# Altium schematic sheet UVS-SCH-1.SchDoc
size A4
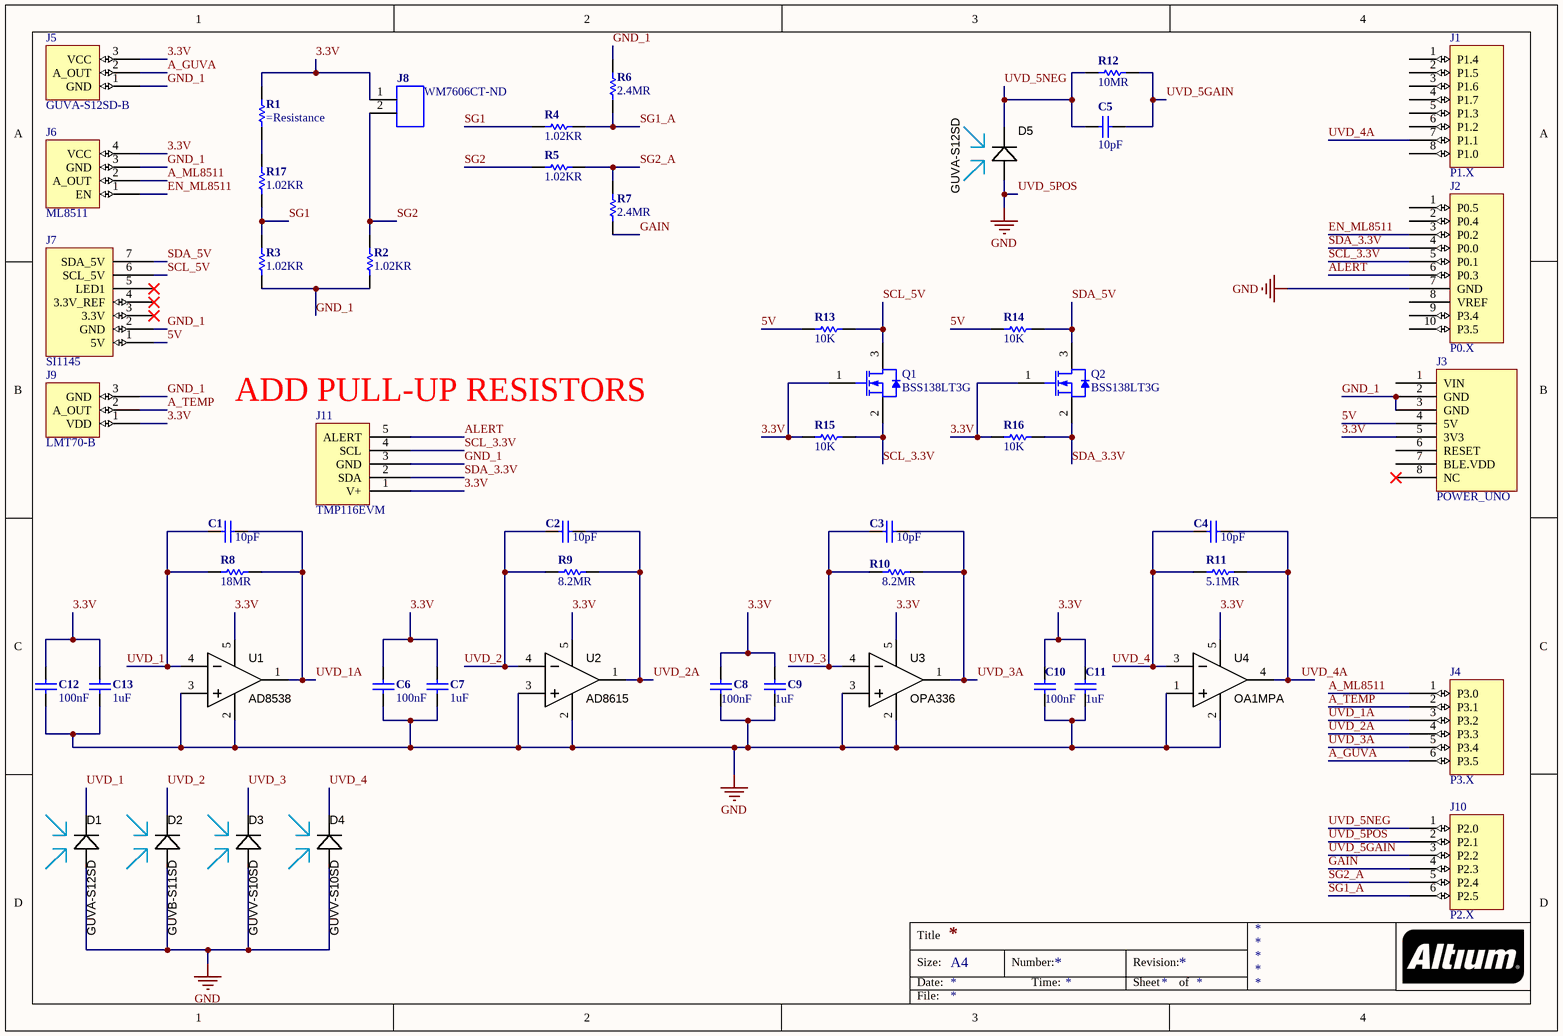
[diagram p0: UVS-SCH-1.SchDoc]

## Parts
C1  10pF  [CAP-0805(2012)-R]
C2  10pF  [CAP-0805(2012)-R]
C3  10pF  [CAP-0805(2012)-R]
C4  10pF  [CAP-0805(2012)-R]
C5  10pF  [CAP-0805(2012)-R]
C6  100nF  [CAP-0805(2012)-R]
C7  1uF  [CAP-0805(2012)-R]
C8  100nF  [CAP-0805(2012)-R]
C9  1uF  [CAP-0805(2012)-R]
C10  100nF  [CAP-0805(2012)-R]
C11  1uF  [CAP-0805(2012)-R]
C12  100nF  [CAP-0805(2012)-R]
C13  1uF  [CAP-0805(2012)-R]
D1  GUVA-S12SD  [SMD 3528]
D2  GUVB-S11SD  [SMD 3528]
D3  GUVV-S10SD  [SMD 3528]
D4  GUVV-S10SD  [SMD 3528]
D5  GUVA-S12SD  [SMD 3528]
J1  P1.X  [Header 8x1 8.5mm]
J2  P0.X  [Header 10x1 8.5mm]
J3  POWER_UNO  [Header 8x1 8.5mm]
J4  P3.X  [Header 6x1 8.5mm]
J5  GUVA-S12SD-B  [Header 3x1 8.5mm]
J6  ML8511  [Header 4x1 8.5mm]
J7  SI1145  [Header 7x1 8.5mm]
J8  Header 2 pin  [WM7606CT-ND]  (value not drawn)
J9  LMT70-B  [Header 3x1 8.5mm]
J10  P2.X  [Header 6x1 8.5mm]
J11  TMP116EVM  [Header 5x1 8.5mm]
Q1  BSS138LT3G  [ONSC-SOT-23-3-318-08_V]
Q2  BSS138LT3G  [ONSC-SOT-23-3-318-08_V]
R1  (no value)  [R-0805(2012)-R]
R2  1.02KR  [R-0805(2012)-R]
R3  1.02KR  [R-0805(2012)-R]
R4  1.02KR  [R-0805(2012)-R]
R5  1.02KR  [R-0805(2012)-R]
R6  2.4MR  [R-0805(2012)-R]
R7  2.4MR  [R-0805(2012)-R]
R8  18MR  [R-0805(2012)-R]
R9  8.2MR  [R-0805(2012)-R]
R10  8.2MR  [R-0805(2012)-R]
R11  5.1MR  [R-0805(2012)-R]
R12  10MR  [R-0805(2012)-R]
R13  10K  [R-0805(2012)-R]
R14  10K  [R-0805(2012)-R]
R15  10K  [R-0805(2012)-R]
R16  10K  [R-0805(2012)-R]
R17  1.02KR  [R-0805(2012)-R]
U1  AD8538  [SOT23-5]
U2  AD8615  [SOT23-5]
U3  OPA336  [SOT23-5]
U4  OA1MPA  [SC70-5L]

## Nets
UVD_5POS: C6.2 C7.2 C8.2 C9.2 C10.2 C11.2 C12.2 C13.2 D1.A D2.A D3.A D4.A D5.A J2.7(GND) J10.2(P2.1) U1.2(V-) U1.3(IN+) U2.2(V-) U2.3(IN+) U3.2(V-) U3.3(IN+) U4.1(OUT) U4.2(V-)  [also labelled GND]
3.3V: C6.1 C7.1 C8.1 C9.1 C10.1 C11.1 C12.1 C13.1 J3.5(3V3) J5.3(VCC) J6.4(VCC) J8.1 J9.1(VDD) J11.1(V+) Q1.1(G) Q2.1(G) R1.1 R15.1 R16.1 U1.5(V+) U2.5(V+) U3.5(V+) U4.5(V+)
5V: J3.4(5V) J7.1(5V) R13.1 R14.1
A_GUVA: J4.6(P3.5) J5.2(A_OUT)
A_ML8511: J4.1(P3.0) J6.2(A_OUT)
A_TEMP: J4.2(P3.1) J9.2(A_OUT)
ALERT: J2.6(P0.3) J11.5(ALERT)
EN_ML8511: J2.3(P0.2) J6.1(EN)
GAIN: J10.4(P2.3) R7.2
GND_1: J3.2(GND) J3.3(GND) J5.1(GND) J6.3(GND) J7.2(GND) J9.3(GND) J11.3(GND) R2.2 R3.2 R6.1
SCL_3.3V: J2.5(P0.1) J11.4(SCL) Q1.2(S) R15.2
SCL_5V: J7.6(SCL_5V) Q1.3(D) R13.2
SDA_3.3V: J2.4(P0.0) J11.2(SDA) Q2.2(S) R16.2
SDA_5V: J7.7(SDA_5V) Q2.3(D) R14.2
SG1: R3.1 R4.1 R17.2
SG1_A: J10.6(P2.5) R4.2 R6.2
SG2: J8.2 R2.1 R5.1
SG2_A: J10.5(P2.4) R5.2 R7.1
UVD_1: C1.1 D1.K R8.1 U1.4(IN-)
UVD_1A: C1.2 J4.3(P3.2) R8.2 U1.1(OUT)
UVD_2: C2.1 D2.K R9.1 U2.4(IN-)
UVD_2A: C2.2 J4.4(P3.3) R9.2 U2.1(OUT)
UVD_3: C3.1 D3.K R10.1 U3.4(IN-)
UVD_3A: C3.2 J4.5(P3.4) R10.2 U3.1(OUT)
UVD_4: C4.1 D4.K R11.1 U4.3(IN+)
UVD_4A: C4.2 J1.7(P1.1) R11.2 U4.4(IN-)
UVD_5GAIN: C5.2 J10.3(P2.2) R12.2
UVD_5NEG: C5.1 D5.K J10.1(P2.0) R12.1
NetR1_2: R1.2 R17.1

Not connected (* = marked no-connect by the designer): J1 1(P1.4) 2(P1.5) 3(P1.6) 4(P1.7) 5(P1.3) 6(P1.2) 8(P1.0); J2 1(P0.5) 2(P0.4) 8(VREF) 9(P3.4) 10(P3.5); J3 1(VIN) 6(RESET) 7(BLE.VDD) 8(NC)*; J7 3(3.3V)* 4(3.3V_REF)* 5(LED1)*

## Notes on the sheet
- (near J11) ADD PULL-UP RESISTORS
- Title
- Size:
- Date:
- A4
- Number:
- Time:
- Revision:
- Sheet
- of
- File:

## Library data of the parts
C1-C4 = C-0805(2012): ___ OHM ___ mW 0805(2012) SMD; Manufacturer: Kemet; Manufacturer Part Number: C0805C100J5GAC-TU; Dielectric Material: Ceramic; Tolerance: 5%; Voltage Rating: 50V; Dielectric: C0G; Dissipation Factor: 0.1%; Temperature Coefficient: 30ppm/°C; Supplier 1: Mouser; Supplier Part Number 1: 80-C0805C100J5G; Stock 1: 118205; Pricing 1: 1=0.1, 10=0.04, 50=0.04, 100=0.028, 1000=0.019, 10000=0.012 (USD); Mount: Surface Mount; Case/Package: 0805; Number of Pins: 2; Case Code (Metric): 2012; Case Code (Imperial): 0805; Contact Material: Tin; Contact Plating: Tin; Min Operating Temperature: -55°C; Max Operating Temperature: 125°C; Capacitance: 10pF; Package Quantity: 1; Packaging: Tape and Reel; Voltage Rating (DC): 50V; Termination: SMD/SMT; Voltage: 50V; Length: 2mm; Height: 0.78mm; Width: 0.049inch; Depth: 1.25mm; Lead Pitch: 0.75mm; Thickness: 0.035inch; Radiation Hardening: No; Lead Free: Lead Free; REACH SVHC: No SVHC; ComponentLink1URL: https://datasheet.ciiva.com/144/docfinderpartnumber-c0805c100j5gactu-144802.pdf; ComponentLink1Description: https://datasheet.ciiva.com/144/docfinderpartnumber-c0805c100j5gactu-144802.pdf; ComponentLink2URL: https://datasheet.ciiva.com/6177/kem-c1003-c0g-smd-6177333.pdf; ComponentLink2Description: https://datasheet.ciiva.com/6177/kem-c1003-c0g-smd-6177333.pdf; ComponentLink3URL: https://datasheet.ciiva.com/28668/1789732-28668730.pdf; ComponentLink3Description: https://datasheet.ciiva.com/28668/1789732-28668730.pdf; ComponentLink4URL: https://datasheet.ciiva.com/5423/kem-c1003-c0g-smd-356956-5423483.pdf; ComponentLink4Description: https://datasheet.ciiva.com/5423/kem-c1003-c0g-smd-356956-5423483.pdf; ComponentLink5URL: https://datasheet.ciiva.com/14609/70095383-14609227.pdf; ComponentLink5Description: https://datasheet.ciiva.com/14609/70095383-14609227.pdf; ComponentLink6URL: https://datasheet.ciiva.com/2988/kem-c1003-c0g-smd-2988556.pdf; ComponentLink6Description: https://datasheet.ciiva.com/2988/kem-c1003-c0g-smd-2988556.pdf; ComponentLink7URL: https://datasheet.ciiva.com/7842/1725430-7842140.pdf; ComponentLink7Description: https://datasheet.ciiva.com/7842/1725430-7842140.pdf; ComponentLink8URL: https://datasheet.ciiva.com/7842/1725430-7842141.pdf; ComponentLink8Description: https://datasheet.ciiva.com/7842/1725430-7842141.pdf
C5 = C-0805(2012): ___ OHM ___ mW 0805(2012) SMD; Manufacturer: KEMET; Manufacturer Part Number: C0805C100J5GAC-TU; Dielectric Material: Ceramic; Tolerance: 5%; Voltage Rating: 50V; Dielectric: C0G; Dissipation Factor: 0.1%; Temperature Coefficient: 30ppm/°C; Supplier 1: Mouser; Supplier Part Number 1: 80-C0805C100J5G; Stock 1: 113433; Pricing 1: 1=0.1, 10=0.04, 50=0.04, 100=0.028, 1000=0.019, 10000=0.012 (USD); Mount: Surface Mount; Case/Package: 0805; Number of Pins: 2; Case Code (Metric): 2012; Case Code (Imperial): 0805; Contact Material: Tin; Contact Plating: Tin; Min Operating Temperature: -55°C; Max Operating Temperature: 125°C; Capacitance: 10pF; Package Quantity: 1; Packaging: Tape and Reel; Voltage Rating (DC): 50V; Termination: SMD/SMT; Voltage: 50V; Length: 2mm; Height: 0.78mm; Width: 0.049inch; Depth: 1.25mm; Lead Pitch: 0.75mm; Thickness: 0.035inch; Radiation Hardening: No; Lead Free: Lead Free; REACH SVHC: No SVHC; ComponentLink1URL: https://datasheet.ciiva.com/144/docfinderpartnumber-c0805c100j5gactu-144802.pdf; ComponentLink1Description: https://datasheet.ciiva.com/144/docfinderpartnumber-c0805c100j5gactu-144802.pdf; ComponentLink2URL: https://datasheet.ciiva.com/6177/kem-c1003-c0g-smd-6177333.pdf; ComponentLink2Description: https://datasheet.ciiva.com/6177/kem-c1003-c0g-smd-6177333.pdf; ComponentLink3URL: https://datasheet.ciiva.com/28668/1789732-28668730.pdf; ComponentLink3Description: https://datasheet.ciiva.com/28668/1789732-28668730.pdf; ComponentLink4URL: https://datasheet.ciiva.com/5423/kem-c1003-c0g-smd-356956-5423483.pdf; ComponentLink4Description: https://datasheet.ciiva.com/5423/kem-c1003-c0g-smd-356956-5423483.pdf; ComponentLink5URL: https://datasheet.ciiva.com/14609/70095383-14609227.pdf; ComponentLink5Description: https://datasheet.ciiva.com/14609/70095383-14609227.pdf; ComponentLink6URL: https://datasheet.ciiva.com/2988/kem-c1003-c0g-smd-2988556.pdf; ComponentLink6Description: https://datasheet.ciiva.com/2988/kem-c1003-c0g-smd-2988556.pdf; ComponentLink7URL: https://datasheet.ciiva.com/7842/1725430-7842140.pdf; ComponentLink7Description: https://datasheet.ciiva.com/7842/1725430-7842140.pdf; ComponentLink8URL: https://datasheet.ciiva.com/7842/1725430-7842141.pdf; ComponentLink8Description: https://datasheet.ciiva.com/7842/1725430-7842141.pdf
C6 C8 C10 C12 = C-0805(2012): ___ OHM ___ mW 0805(2012) SMD; Manufacturer: Yageo; Manufacturer Part Number: CC0805KRX7R9BB104; Material: Ceramic; Tolerance: 10%; Voltage Rating: 50V; Dielectric: X7R; Insulation Resistance: 100GR; Supplier 1: Mouser; Supplier Part Number 1: 603-CC805KRX7R9BB104; Stock 1: 432978; Pricing 1: 1=0.1, 10=0.037, 50=0.037, 100=0.017, 1000=0.013, 10000=0.009 (USD); Mount: Surface Mount; Case/Package: 0805; Number of Pins: 2; Case Code (Metric): 2012; Case Code (Imperial): 0805; Min Operating Temperature: -55°C; Max Operating Temperature: 125°C; Packaging: Tape and Reel; Capacitance: 100nF; Package Quantity: 1; Termination: SMD/SMT; Voltage: 50V; Length: 2mm; Height: 0.85mm; Width: 0.049inch; Thickness: 0.033inch; Depth: 1.25mm; Radiation Hardening: No; REACH SVHC: No SVHC; Lead Free: Lead Free; Halogen Free: Halogen Free; ComponentLink1URL: https://datasheet.ciiva.com/11464/upy-gphc-x7r-6-3v-to-50v-8-11464757.pdf; ComponentLink1Description: https://datasheet.ciiva.com/11464/upy-gphc-x7r-6-3v-to-50v-8-11464757.pdf; ComponentLink2URL: https://datasheet.ciiva.com/28450/1489800-28450805.pdf; ComponentLink2Description: https://datasheet.ciiva.com/28450/1489800-28450805.pdf; ComponentLink3URL: https://datasheet.ciiva.com/155/mlccorderingcode-155929.pdf; ComponentLink3Description: https://datasheet.ciiva.com/155/mlccorderingcode-155929.pdf; ComponentLink4URL: https://datasheet.ciiva.com/11786/0900766b80d84f1d-11786009.pdf; ComponentLink4Description: https://datasheet.ciiva.com/11786/0900766b80d84f1d-11786009.pdf; ComponentLink5URL: https://datasheet.ciiva.com/155/mlccorderingcode-155930.pdf; ComponentLink5Description: https://datasheet.ciiva.com/155/mlccorderingcode-155930.pdf; ComponentLink6URL: https://datasheet.ciiva.com/155/mlccorderingcode-155931.pdf; ComponentLink6Description: https://datasheet.ciiva.com/155/mlccorderingcode-155931.pdf; ComponentLink7URL: https://datasheet.ciiva.com/46393/1734573-46393307.pdf; ComponentLink7Description: https://datasheet.ciiva.com/46393/1734573-46393307.pdf; ComponentLink8URL: https://datasheet.ciiva.com/16625/upy-gphc-x7r-6-3v-to-50v-8-16625549.pdf; ComponentLink8Description: https://datasheet.ciiva.com/16625/upy-gphc-x7r-6-3v-to-50v-8-16625549.pdf; ComponentLink9URL: https://datasheet.ciiva.com/29242/445210-da-01-en-kerko-chip-0805-x7r-0-1uf-10proz-50vg-29242074.pdf; ComponentLink9Description: https://datasheet.ciiva.com/29242/445210-da-01-en-kerko-chip-0805-x7r-0-1uf-10proz-50vg-29242074.pdf
C7 C9 C11 C13 = C-0805(2012): ___ OHM ___ mW 0805(2012) SMD; Manufacturer: Yageo; Manufacturer Part Number: CC0805KKX7R7BB105; Tolerance: 10%; Voltage Rating: 16V; Dielectric: X7R; Supplier 1: Mouser; Supplier Part Number 1: 603-CC805KKX7R7BB105; Stock 1: 127286; Pricing 1: 1=0.1, 10=0.049, 50=0.049, 100=0.022, 1000=0.017, 10000=0.011 (USD); Case/Package: 0805; Case Code (Metric): 2012; Case Code (Imperial): 0805; Min Operating Temperature: -55°C; Max Operating Temperature: 125°C; Packaging: Tape and Reel; Capacitance: 1uF; Package Quantity: 1; Termination: SMD/SMT; Voltage Rating (DC): 16V; Length: 2mm; Width: 0.049inch; Thickness: 0.049inch; Depth: 1.25mm; Radiation Hardening: No; REACH SVHC: No SVHC; Lead Free: Lead Free; Halogen Free: Halogen Free; ComponentLink1URL: https://datasheet.ciiva.com/144/mlccorderingcode-144902.pdf; ComponentLink1Description: https://datasheet.ciiva.com/144/mlccorderingcode-144902.pdf; ComponentLink2URL: https://datasheet.ciiva.com/13173/upy-gp-np0-16v-to-50v-8-3714-13173254.pdf; ComponentLink2Description: https://datasheet.ciiva.com/13173/upy-gp-np0-16v-to-50v-8-3714-13173254.pdf; ComponentLink3URL: https://datasheet.ciiva.com/15189/getdatasheetpartid-251802-15189206.pdf; ComponentLink3Description: https://datasheet.ciiva.com/15189/getdatasheetpartid-251802-15189206.pdf; ComponentLink4URL: https://datasheet.ciiva.com/144/mlccorderingcode-144903.pdf; ComponentLink4Description: https://datasheet.ciiva.com/144/mlccorderingcode-144903.pdf; ComponentLink5URL: https://datasheet.ciiva.com/144/mlccorderingcode-144904.pdf; ComponentLink5Description: https://datasheet.ciiva.com/144/mlccorderingcode-144904.pdf; ComponentLink6URL: https://datasheet.ciiva.com/7978/1489800-7978201.pdf; ComponentLink6Description: https://datasheet.ciiva.com/7978/1489800-7978201.pdf; ComponentLink7URL: https://datasheet.ciiva.com/11464/upy-gphc-x7r-6-3v-to-50v-8-11464750.pdf; ComponentLink7Description: https://datasheet.ciiva.com/11464/upy-gphc-x7r-6-3v-to-50v-8-11464750.pdf; ComponentLink8URL: https://datasheet.ciiva.com/28450/1489800-28450750.pdf; ComponentLink8Description: https://datasheet.ciiva.com/28450/1489800-28450750.pdf
D1 D5 = GUVA-S12SD: UV Photodiode, 3528 SMD
D2 = GUVB-S11SD: UV Photodiode, 3528 SMD
D3 D4 = GUVV-S10SD: UV Photodiode, 3528 SMD
J1 = IOL
J2 = IOH
J4 = AD
J5 = GUVA-S12SD-B: UV Light Sensor Breakout Board
J6 = ML8511: UV Light Sensor Breakout Board
J7 = SI1145: UV Light Sensor Digital
J8 = CON-2Pin: Header, 2 pin, .1 pitch; Manufacturer: Molex, LLC; Manufacturer Part Number: 0533980271; Pitch - Mating: 0.049" (1.25mm); Style: Board to Cable/Wire; Shrouding: Shrouded - 3 Wall; Number of Positions: 2; Number of Positions Loaded: All; Material Flammability Rating: UL94 V-0; Supplier 1: Digi-Key; RoHS: RoHS Compliant; Category: Connectors, Interconnects; Stock 1: 38010; Pricing 1: 1=1.07, 10=0.941, 25=0.886, 50=0.849, 100=0.8122, 250=0.73832, 500=0.66448 (USD); Packaging: Cut Tape (CT); Part Status: Active; Connector Type: Header; Contact Type: Male Blade; Number of Rows: 1; Row Spacing - Mating: -; Mounting Type: Surface Mount; Termination: Solder; Fastening Type: Detent Lock; Contact Length - Mating: -; Contact Length - Post: -; Overall Contact Length: -; Insulation Height: 0.185" (4.70mm); Contact Shape: Rectangular; Contact Finish - Mating: Tin; Contact Finish Thickness - Mating: 39µin (1.00µm); Features: Solder Retention; Ingress Protection: -; Insulation Color: Natural; Contact Finish - Post: Tin; Contact Material: Phosphor Bronze; Insulation Material: Polyamide (PA), Nylon; Operating Temperature: -; Current Rating: -; Voltage Rating: -; Mated Stacking Heights: -; Contact Finish Thickness - Post: -; Applications: Automotive, General Purpose, Industrial, Medical; ComponentLink1URL: http://www.molex.com/pdm_docs/sd/533980271_sd.pdf; ComponentLink1Description: http://www.molex.com/pdm_docs/sd/533980271_sd.pdf; Supplier Part Number 1: WM7606CT-ND
J9 = LMT70-B: Precision Analog Temperature Sensor
Q1 Q2 = CMP-1058-00765-1: Power MOSFET, 200 mA, 50 V, N-Channel, 3-Pin SOT-23, Pb-Free, Tape and Reel; Manufacturer: ON Semiconductor; Nominal Vgs: 500mV; Input Capacitance: 50pF; Number of Elements: 1; Max Power Dissipation: 225mW; Rds On Max: 3.5R; Drain to Source Voltage (Vdss): 50V; Continuous Drain Current (ID): 200mA; Turn-Off Delay Time: 20ns; Element Configuration: Single; Gate to Source Voltage (Vgs): 20V; Supplier 1: Mouser; Supplier Part Number 1: 863-BSS138LT3G; Manufacturer Part Number: BSS138LT3G; Stock 1: 150086; Pricing 1: 1=0.25, 10=0.167, 50=0.167, 100=0.07, 1000=0.048, 10000=0.032 (USD); Case/Package: SOT-23-3; Number of Pins: 3; Min Operating Temperature: -55°C; Max Operating Temperature: 150°C; Package Quantity: 1; Packaging: Tape and Reel; Drain to Source Breakdown Voltage: 50V; Power Dissipation: 225mW; Drain to Source Resistance: 3.5R; Threshold Voltage: 500mV; Turn-On Delay Time: 20ns; Voltage Rating (DC): 50V; Current Rating: 200mA; Length: 2.9mm; Height: 0.94mm; Width: 1.3mm; Radiation Hardening: No; REACH SVHC: No SVHC; Lead Free: Lead Free; Halogen Free: Halogen Free; ComponentLink1URL: https://datasheet.ciiva.com/936/bss138lt1-d-936790.pdf; ComponentLink1Description: https://datasheet.ciiva.com/936/bss138lt1-d-936790.pdf; ComponentLink2URL: https://datasheet.ciiva.com/936/bss138lt1-d-936791.pdf; ComponentLink2Description: https://datasheet.ciiva.com/936/bss138lt1-d-936791.pdf; ComponentLink3URL: https://datasheet.ciiva.com/1190/1596366-1190138.pdf; ComponentLink3Description: https://datasheet.ciiva.com/1190/1596366-1190138.pdf; ComponentLink4URL: https://datasheet.ciiva.com/8059/bss138lt1-d-8059434.pdf; ComponentLink4Description: https://datasheet.ciiva.com/8059/bss138lt1-d-8059434.pdf; ComponentLink5URL: https://datasheet.ciiva.com/11164/bss138lt1-d-11164859.pdf; ComponentLink5Description: https://datasheet.ciiva.com/11164/bss138lt1-d-11164859.pdf; ComponentLink6URL: https://datasheet.ciiva.com/15198/getdatasheetpartid-141721-15198909.pdf; ComponentLink6Description: https://datasheet.ciiva.com/15198/getdatasheetpartid-141721-15198909.pdf; ComponentLink7URL: https://datasheet.ciiva.com/16449/bss138lt1-d-16449517.pdf; ComponentLink7Description: https://datasheet.ciiva.com/16449/bss138lt1-d-16449517.pdf
R1 = R-0805(2012): ___ OHM ___ mW 0805(2012) SMD
R2-R5 R17 = R-0805(2012): ___ OHM ___ mW 0805(2012) SMD; Manufacturer: Panasonic; Manufacturer Part Number: ERA6AEB1021V; Power Rating: 125mW; Tolerance: 0.1%; Voltage Rating: 200V; Temperature Coefficient: 25ppm/°C; Voltage Rating (DC): 100V; Supplier 1: Mouser; Supplier Part Number 1: 667-ERA-6AEB1021V; Stock 1: 5493; Pricing 1: 1=0.63, 10=0.249, 50=0.249, 100=0.149, 1000=0.076, 10000=0.039 (USD); Mount: Surface Mount; Case/Package: 0805; Number of Pins: 2; Case Code (Metric): 2012; Case Code (Imperial): 0805; Contact Plating: Tin; Min Operating Temperature: -55°C; Max Operating Temperature: 155°C; Composition: Metal Film,Thin Film; Resistance: 1.02KR; Packaging: Tape and Reel; Package Quantity: 1; Number of Terminations: 2; Termination: SMD/SMT; Max Power Dissipation: 125mW; Length: 2mm; Height: 0.5mm; Width: 1.25mm; Depth: 1.25mm; Radiation Hardening: No; REACH SVHC: No SVHC; Lead Free: Lead Free; ComponentLink1URL: https://datasheet.ciiva.com/5870/485442-5870581.pdf; ComponentLink1Description: https://datasheet.ciiva.com/5870/485442-5870581.pdf; ComponentLink2URL: https://datasheet.ciiva.com/5870/485442-5870582.pdf; ComponentLink3URL: https://datasheet.ciiva.com/24072/aoa0000ce26-197354-24072246.pdf; ComponentLink3Description: https://datasheet.ciiva.com/24072/aoa0000ce26-197354-24072246.pdf; ComponentLink4URL: https://datasheet.ciiva.com/30091/54aoa0000ce26-30091290.pdf; ComponentLink4Description: https://datasheet.ciiva.com/30091/54aoa0000ce26-30091290.pdf; ComponentLink5URL: https://datasheet.ciiva.com/7911/485442-7911579.pdf; ComponentLink5Description: https://datasheet.ciiva.com/7911/485442-7911579.pdf; ComponentLink6URL: https://datasheet.ciiva.com/9198/aoa0000ce26-9198827.pdf; ComponentLink6Description: https://datasheet.ciiva.com/9198/aoa0000ce26-9198827.pdf; ComponentLink7URL: https://datasheet.ciiva.com/7911/485442-7911580.pdf; ComponentLink7Description: https://datasheet.ciiva.com/7911/485442-7911580.pdf; ComponentLink8URL: https://datasheet.ciiva.com/11810/0900766b80eb1d8c-11810140.pdf; ComponentLink8Description: https://datasheet.ciiva.com/11810/0900766b80eb1d8c-11810140.pdf; ComponentLink9URL: https://datasheet.ciiva.com/17215/aoa0000ce26-17215164.pdf; ComponentLink9Description: https://datasheet.ciiva.com/17215/aoa0000ce26-17215164.pdf; ComponentLink10URL: https://datasheet.ciiva.com/26335/459032-da-01-en-widerstand-0805-era-26335793.pdf
  R2-R4 R17: ComponentLink2Description: https://datasheet.ciiva.com/5870/485442-5870582.pdf; ComponentLink10Description: https://datasheet.ciiva.com/26335/459032-da-01-en-widerstand-0805-era-26335793.pdf
R6 R7 = R-0805(2012): ___ OHM ___ mW 0805(2012) SMD; Manufacturer: Panasonic ECG; Manufacturer Part Number: ERJ-6GEYJ245V; Power Rating: 125mW; Tolerance: 5%; Voltage Rating: 150V; Temperature Coefficient: 150ppm/°C; Supplier 1: Mouser; Supplier Part Number 1: 667-ERJ-6GEYJ245V; Stock 1: 75536; Pricing 1: 1=0.1, 10=0.015, 50=0.015, 100=0.006, 1000=0.004, 10000=0.002 (USD); Mount: Surface Mount; Case/Package: 0805; Case Code (Imperial): 0805; Case Code (Metric): 2012; Contact Plating: Tin; Min Operating Temperature: -55°C; Max Operating Temperature: 155°C; Resistance: 2.4MR; Packaging: Tape and Reel; Package Quantity: 1; Termination: SMD/SMT; Composition: Thick Film; Number of Terminations: 2; Military Standard: Not; Max Power Dissipation: 125mW; Voltage Rating (DC): 150V; Length: 2mm; Height: 0.028inch; Width: 1.25mm; Depth: 1.25mm; REACH SVHC: No SVHC; Lead Free: Lead Free; ComponentLink1URL: https://datasheet.ciiva.com/9197/aoa0000ce1-9197110.pdf; ComponentLink1Description: https://datasheet.ciiva.com/9197/aoa0000ce1-9197110.pdf; ComponentLink2URL: https://datasheet.ciiva.com/46378/1678796-46378639.pdf; ComponentLink2Description: https://datasheet.ciiva.com/46378/1678796-46378639.pdf
R8 = R-0805(2012): ___ OHM ___ mW 0805(2012) SMD; Manufacturer: Yageo; Manufacturer Part Number: RC0805JR-0718ML; Tolerance: 5%; Power Rating: 125mW; Voltage Rating: 150V; Temperature Coefficient: 200ppm/°C; Supplier 1: Mouser; Supplier Part Number 1: 603-RC0805JR-0718ML; Stock 1: 23485; Pricing 1: 1=0.19, 10=0.045, 50=0.045, 100=0.015, 1000=0.011, 10000=0.006 (USD); Case/Package: 0805; Case Code (Imperial): 0805; Case Code (Metric): 2012; Min Operating Temperature: -55°C; Max Operating Temperature: 155°C; Resistance: 18MR; Packaging: Tape and Reel; Composition: Thick Film; Termination: SMD/SMT; Number of Terminations: 2; Military Standard: Not; Max Power Dissipation: 125mW; Length: 2mm; Height: 0.024inch; Width: 1.25mm; Depth: 1.25mm; REACH SVHC: Unknown; ComponentLink1URL: https://datasheet.ciiva.com/7941/442941-7941901.pdf; ComponentLink1Description: https://datasheet.ciiva.com/7941/442941-7941901.pdf; ComponentLink2URL: https://datasheet.ciiva.com/7941/442941-7941902.pdf; ComponentLink2Description: https://datasheet.ciiva.com/7941/442941-7941902.pdf
R9 R10 = R-0805(2012): ___ OHM ___ mW 0805(2012) SMD; Manufacturer: Yageo; Manufacturer Part Number: RC0805FR-078M2L; Power Rating: 125mW; Tolerance: 1%; Voltage Rating: 150V; Temperature Coefficient: 100ppm/°C; Supplier 1: Mouser; Supplier Part Number 1: 603-RC0805FR-078M2L; Stock 1: 52831; Pricing 1: 1=0.1, 10=0.015, 50=0.015, 100=0.005, 1000=0.004, 10000=0.002 (USD); Case/Package: 0805; Number of Pins: 2; Case Code (Imperial): 0805; Case Code (Metric): 2012; Min Operating Temperature: -55°C; Max Operating Temperature: 155°C; Resistance: 8.2MR; Voltage Rating (DC): 150V; Packaging: Tape and Reel; Composition: Thick Film; Number of Terminations: 2; Termination: SMD/SMT; Max Power Dissipation: 125mW; Length: 0.079inch; Height: 0.024inch; Width: 1.25mm; REACH SVHC: No SVHC; ComponentLink1URL: https://datasheet.ciiva.com/6135/444164-6135430.pdf; ComponentLink1Description: https://datasheet.ciiva.com/6135/444164-6135430.pdf; ComponentLink2URL: https://datasheet.ciiva.com/7941/444164-7941849.pdf; ComponentLink2Description: https://datasheet.ciiva.com/7941/444164-7941849.pdf; ComponentLink3URL: https://datasheet.ciiva.com/7941/444164-7941850.pdf; ComponentLink3Description: https://datasheet.ciiva.com/7941/444164-7941850.pdf; ComponentLink4URL: https://datasheet.ciiva.com/6135/444164-6135422.pdf; ComponentLink4Description: https://datasheet.ciiva.com/6135/444164-6135422.pdf
R11 = R-0805(2012): ___ OHM ___ mW 0805(2012) SMD; Manufacturer: Yageo; Manufacturer Part Number: RC0805FR-075M1L; Power Rating: 125mW; Tolerance: 1%; Voltage Rating: 150V; Temperature Coefficient: 100ppm/°C; Supplier 1: Mouser; Supplier Part Number 1: 603-RC0805FR-075M1L; Stock 1: 45922; Pricing 1: 1=0.1, 10=0.015, 50=0.015, 100=0.005, 1000=0.004, 10000=0.002 (USD); Case/Package: 0805; Case Code (Imperial): 0805; Case Code (Metric): 2012; Min Operating Temperature: -55°C; Max Operating Temperature: 155°C; Packaging: Tape and Reel; Resistance: 5.1MR; Composition: Thick Film; Number of Terminations: 2; Termination: SMD/SMT; Max Power Dissipation: 125mW; Length: 0.079inch; Height: 0.024inch; Width: 0.049inch; Lead Free: Lead Free; ComponentLink1URL: http://www.yageo.ru/pdf/RC0805.pdf; ComponentLink1Description: http://www.yageo.ru/pdf/RC0805.pdf
R12 = R-0805(2012): ___ OHM ___ mW 0805(2012) SMD; Manufacturer: Yageo; Manufacturer Part Number: RC0805JR-0710ML; Power Rating: 125mW; Tolerance: 5%; Voltage Rating: 150V; Temperature Coefficient: 100ppm/°C; Supplier 1: Mouser; Supplier Part Number 1: 603-RC0805JR-0710ML; Stock 1: 47973; Pricing 1: 1=0.1, 10=0.013, 50=0.013, 100=0.005, 1000=0.003, 10000=0.002 (USD); Case/Package: 0805; Case Code (Imperial): 0805; Case Code (Metric): 2012; Contact Plating: Tin,Lead; Min Operating Temperature: -55°C; Max Operating Temperature: 155°C; Resistance: 10MR; Packaging: Tape and Reel; Package Quantity: 1; Termination: SMD/SMT; Composition: Thick Film; Number of Terminations: 2; Military Standard: Not; Max Power Dissipation: 125mW; Length: 0.079inch; Height: 0.024inch; Width: 0.049inch; Depth: 1.25mm; Radiation Hardening: No; REACH SVHC: Unknown; Lead Free: Lead Free; ComponentLink1URL: https://datasheet.ciiva.com/12667/rc0805-12667352.pdf; ComponentLink1Description: https://datasheet.ciiva.com/12667/rc0805-12667352.pdf; ComponentLink2URL: https://datasheet.ciiva.com/2456/pyu-r-int-thick-7-2456140.pdf; ComponentLink2Description: https://datasheet.ciiva.com/2456/pyu-r-int-thick-7-2456140.pdf; ComponentLink3URL: https://datasheet.ciiva.com/2456/pyu-r-int-thick-7-2456141.pdf; ComponentLink3Description: https://datasheet.ciiva.com/2456/pyu-r-int-thick-7-2456141.pdf; ComponentLink4URL: https://datasheet.ciiva.com/2456/pyu-r-int-thick-7-2456142.pdf; ComponentLink4Description: https://datasheet.ciiva.com/2456/pyu-r-int-thick-7-2456142.pdf
R13-R16 = R-0805(2012): ___ OHM ___ mW 0805(2012) SMD; Manufacturer: Yageo; Manufacturer Part Number: RC0805FR-0710KL; Tolerance: 1%; Temperature Coefficient: 100ppm/°C; Power Rating: 125mW; Voltage Rating: 150V; Supplier 1: Mouser; Supplier Part Number 1: 603-RC0805FR-0710KL; Stock 1: 1821555; Pricing 1: 1=0.1, 10=0.016, 50=0.016, 100=0.006, 1000=0.004, 10000=0.003 (USD); Case/Package: 0805; Case Code (Imperial): 0805; Case Code (Metric): 2012; Min Operating Temperature: -55°C; Max Operating Temperature: 155°C; Packaging: Tape and Reel; Resistance: 10K; Composition: Thick Film; Package Quantity: 1; Termination: SMD/SMT; Number of Terminations: 2; Military Standard: Not; Max Power Dissipation: 125mW; Length: 2mm; Height: 0.024inch; Width: 0.049inch; Depth: 1.25mm; REACH SVHC: Unknown; Lead Free: Lead Free; ComponentLink1URL: https://datasheet.ciiva.com/11808/0900766b8106beab-11808151.pdf; ComponentLink1Description: https://datasheet.ciiva.com/11808/0900766b8106beab-11808151.pdf; ComponentLink2URL: https://datasheet.ciiva.com/12669/rc0805-12669688.pdf; ComponentLink2Description: https://datasheet.ciiva.com/12669/rc0805-12669688.pdf; ComponentLink3URL: https://datasheet.ciiva.com/46447/444164-46447563.pdf; ComponentLink3Description: https://datasheet.ciiva.com/46447/444164-46447563.pdf; ComponentLink4URL: https://datasheet.ciiva.com/2456/pyu-r-int-thick-7-2456972.pdf; ComponentLink4Description: https://datasheet.ciiva.com/2456/pyu-r-int-thick-7-2456972.pdf; ComponentLink5URL: https://datasheet.ciiva.com/2456/pyu-r-int-thick-7-2456973.pdf; ComponentLink5Description: https://datasheet.ciiva.com/2456/pyu-r-int-thick-7-2456973.pdf; ComponentLink6URL: https://datasheet.ciiva.com/2456/pyu-r-int-thick-7-2456974.pdf; ComponentLink6Description: https://datasheet.ciiva.com/2456/pyu-r-int-thick-7-2456974.pdf; ComponentLink7URL: https://datasheet.ciiva.com/16747/rc0805-16747087.pdf; ComponentLink7Description: https://datasheet.ciiva.com/16747/rc0805-16747087.pdf
U1 = AD8538: IC SMD Atuo-Zero Op Amp Precision, Low Power; Manufacturer: Analog Devices; Manufacturer Part Number: AD8538AUJZ-REEL7; Number of Channels: 1 Channel; Shutdown: No Shutdown; CMRR - Common Mode Rejection Ratio: 150 dB; en - Input Voltage Noise Density: 50 nV/sqrt Hz at 5 V; GBP - Gain Bandwidth Product: 430 kHz; Ib - Input Bias Current: 25 pA; Maximum Dual Supply Voltage: +/- 2.5 V; Minimum Dual Supply Voltage: +/- 1.35 V; Operating Supply Current: 180 uA; Operating Supply Voltage: 2.7 V to 5.5 V; PSRR - Power Supply Rejection Ratio: 125 dB; SR - Slew Rate: 0.4 V/us at 5 V; Supply Voltage - Max: 5.5 V; Supply Voltage - Min: 2.7 V; Voltage Gain dB: 141 dB; Vos - Input Offset Voltage: 5 uV; Supplier 1: Mouser; RoHS: RoHS Compliant; Category: Precision Amplifiers; Stock 1: 8750; Pricing 1: 1=1.39, 10=1.26, 25=1.12, 100=1.01, 250=0.900, 500=0.788, 1000=0.652, 3000=0.606, 6000=0.601 (USD); Height: 0.87 mm; Length: 2.9 mm; Package / Case: TSOT-5; Packaging: Reel; Product: Precision Amplifiers; Series: AD8538; Type: General Purpose Amplifier; Width: 1.6 mm; Brand: Analog Devices; Mounting Style: SMD/SMT; Maximum Operating Temperature: + 125 C; Minimum Operating Temperature: - 40 C; Standard Pack Qty: 3000; RoHS - Mouser: Y; Minimum Order Quantity: 1; Reeling: True; ComponentLink1URL: http://www.mouser.com/ds/2/609/AD8538_8539-877837.pdf; ComponentLink1Description: http://www.mouser.com/ds/2/609/AD8538_8539-877837.pdf; Supplier Part Number 1: 584-AD8538AUJZ-R7
U2 = AD8615: IC SMD Transimpedance Op Amp Precision; Manufacturer: Analog Devices; Manufacturer Part Number: AD8615AUJZ-REEL7; Output Type: Rail to Rail Input/Output; Input Voltage Range - Max: 5 V; Number of Channels: 1 Channel; Shutdown: No Shutdown; CMRR - Common Mode Rejection Ratio: 100 dB; en - Input Voltage Noise Density: 10 nV/sqrt Hz at 5 V; GBP - Gain Bandwidth Product: 24 MHz; Ib - Input Bias Current: 550 pA; Operating Supply Current: 1.7 mA; Operating Supply Voltage: 2.7 V to 5 V; Output Current per Channel: 150 mA; PSRR - Power Supply Rejection Ratio: 90 dB; SR - Slew Rate: 12 V/us; Supply Voltage - Min: 2.7 V; Voltage Gain dB: 123.52 dB; Vos - Input Offset Voltage: 80 uV; Supplier 1: Mouser; RoHS: RoHS Compliant; Category: Precision Amplifiers; Stock 1: 7346; Pricing 1: 1=2.11, 10=1.91, 25=1.71, 100=1.53, 250=1.36, 500=1.19, 1000=0.992, 3000=0.921, 6000=0.913 (USD); Height: 0.87 mm; Length: 2.9 mm; Package / Case: TSOT-5; Packaging: Reel; Product: Precision Amplifiers; Series: AD8615; Type: General Purpose Amplifier; Width: 1.6 mm; Brand: Analog Devices; Mounting Style: SMD/SMT; Maximum Operating Temperature: + 125 C; Minimum Operating Temperature: - 40 C; Standard Pack Qty: 3000; Supply Voltage - Max: 5 V; RoHS - Mouser: Y; Minimum Order Quantity: 1; Reeling: True; ComponentLink1URL: http://www.mouser.com/ds/2/609/AD8615_8616_8618-877841.pdf; ComponentLink1Description: http://www.mouser.com/ds/2/609/AD8615_8616_8618-877841.pdf; Supplier Part Number 1: 584-AD8615AUJZ-R7
U3 = OPA336: Manufacturer: Texas Instruments; Manufacturer Part Number: OPA336NA/3K; Amplifier Type: Low Power Amplifier; Input Type: Rail-to-Rail; Supply Type: Single; Number of Channels: 1 Channel; Shutdown: No Shutdown; CMRR - Common Mode Rejection Ratio: 76 dB to 86 dB; en - Input Voltage Noise Density: 40 nV/sqrt Hz; GBP - Gain Bandwidth Product: 100 kHz; Ib - Input Bias Current: 10 pA; In - Input Noise Current Density: 30 fA/sqrt Hz; Operating Supply Current: 20 uA; Operating Supply Voltage: 2.3 V to 5.5 V; PSRR - Power Supply Rejection Ratio: 25 uV/V; SR - Slew Rate: 0.03 V/us; Supply Voltage - Max: 5.5 V; Supply Voltage - Min: 2.3 V; Voltage Gain dB: 115 dB; Vos - Input Offset Voltage: 0.125 mV; Supplier 1: Mouser; RoHS: RoHS Compliant; Category: Operational Amplifiers - Op Amps; Stock 1: 11756; Pricing 1: 1=1.72, 10=1.55, 25=1.47, 100=1.24, 250=1.17, 500=1.02, 1000=0.731, 3000=0.731 (USD); Height: 1.15 mm; Length: 2.9 mm; Output Type: Rail-to-Rail; Package / Case: SOT-23-5; Packaging: Reel; Product: Precision Amplifiers; Series: OPA336; Technology: CMOS; Width: 1.6 mm; Brand: Texas Instruments; Mounting Style: SMD/SMT; Ios - Input Offset Current: 10 pA; Maximum Operating Temperature: + 85 C; Minimum Operating Temperature: - 40 C; Standard Pack Qty: 3000; RoHS - Mouser: Y; Minimum Order Quantity: 1; Reeling: True; Supplier Part Number 1: 595-OPA336NA/3K
U4 = OA1MPA: Manufacturer: STMicroelectronics; Manufacturer Part Number: OA1MPA22C; Slew Rate: 0.06V/µs; Number of Circuits: 1; Gain Bandwidth Product: 150KHz; Input Bias Current: 1pA; Input Offset Voltage (Vos): 200uV; Operating Supply Current: 10uA; Output Current per Channel: 56mA; Supply Voltage: 5.5V; Supplier 1: Mouser; Stock 1: 242; Pricing 1: 1=1.27, 10=1.08, 50=1.08, 100=0.832, 1000=0.58, 10000=0.494 (USD); Case/Package: SC; Number of Pins: 5; Min Operating Temperature: -40°C; Max Operating Temperature: 125°C; Package Quantity: 3000; Packaging: Tape and Reel; Bandwidth: 150KHz; Number of Amplifiers: 1; Length: 2.2mm; Height: 1mm; Width: 1.35mm; REACH SVHC: No SVHC; Lead Free: Lead Free; ComponentLink1Description: https://datasheet.ciiva.com/29638/dm00109015-29638347.pdf; Supplier Part Number 1: 511-OA1MPA22C